# Altium schematic sheet STVC.SchDoc: STVC
size 279 x 215 mm; Author: Riley Peterson; Revision: 0; SheetNumber: 1; SheetTotal: 4
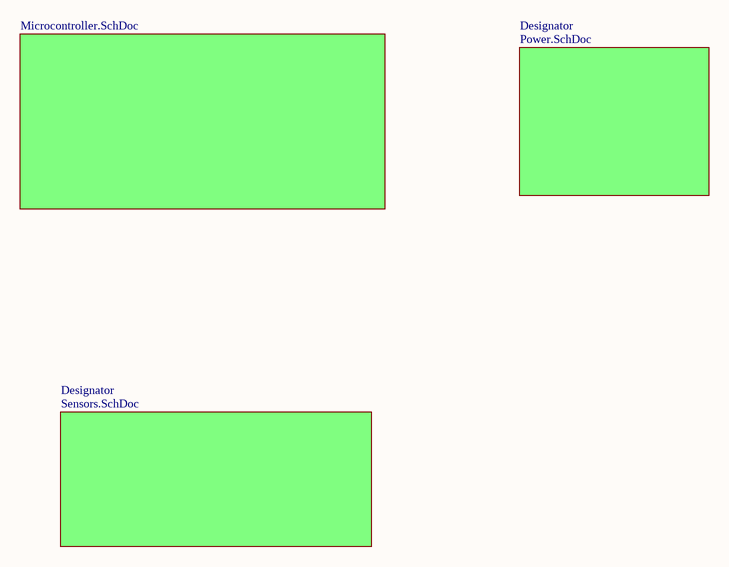
[diagram p0: STVC.SchDoc]

## Sub-sheets
Designator = Sensors.SchDoc: no entries
Designator = Microcontroller.SchDoc: no entries
Designator = Power.SchDoc: no entries

## Notes on the sheet
- Title
- Author
- Date
- Texas A&M Sounding Rocketry Team
- Revision